# EAGLE design untitled (EAGLE 9.6.2)
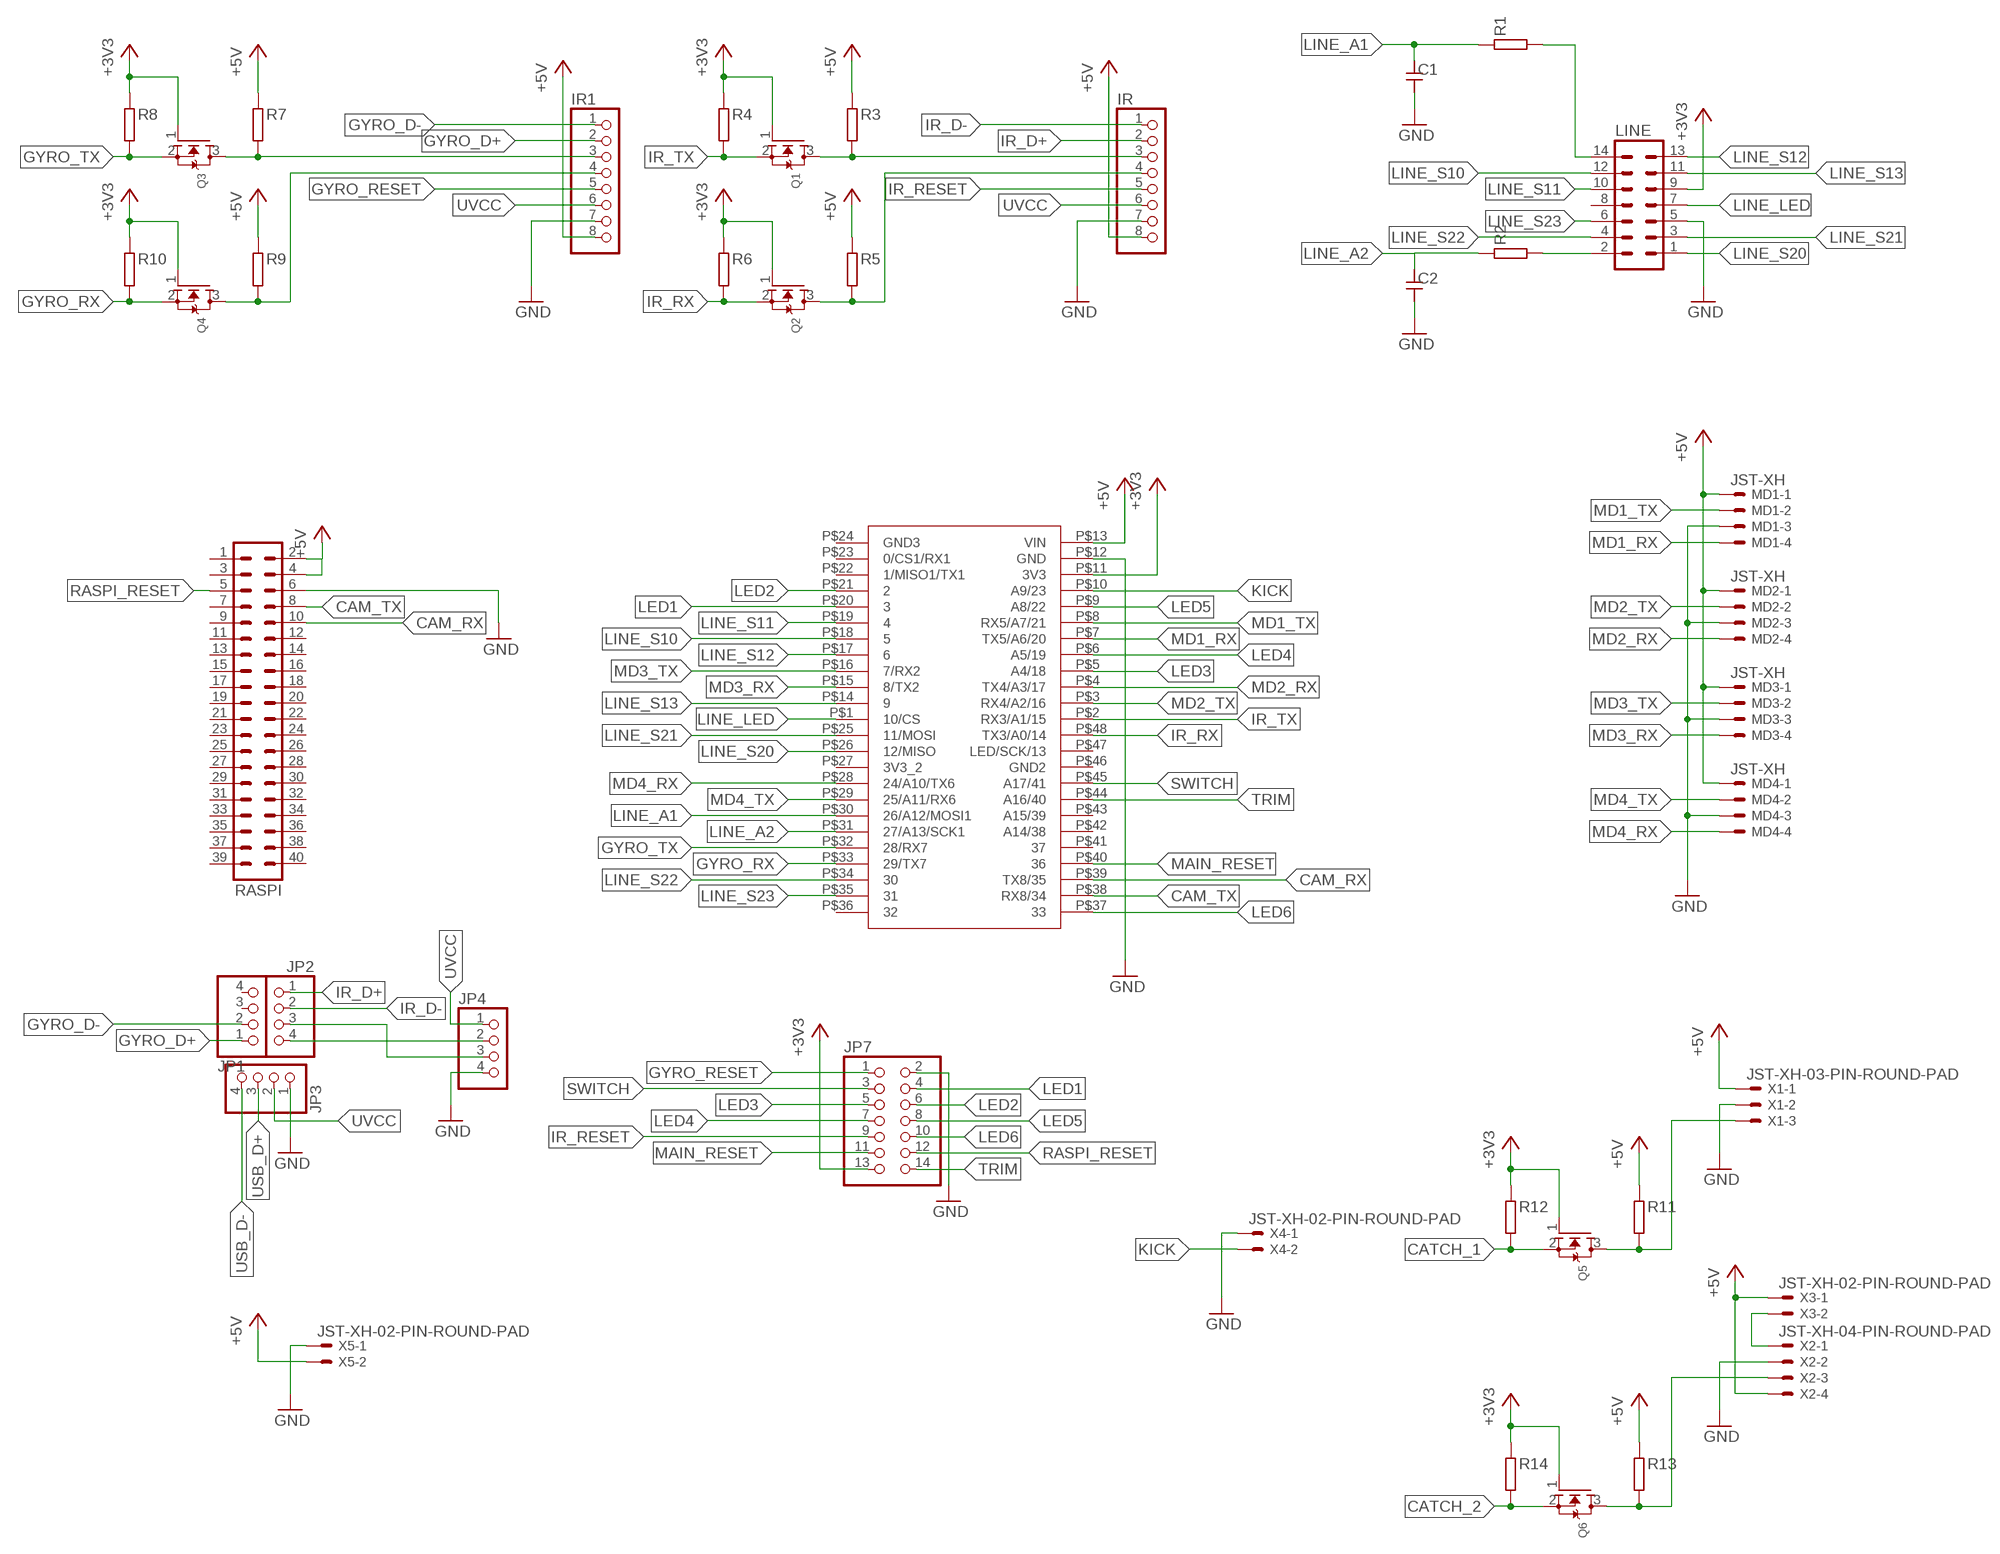
[diagram p0: schematic, sheet 1]

## Parts
C1  CAPACITOR1608  [SMD1608]
C2  CAPACITOR1608  [SMD1608]
IR  PINHD-1X8  [1X08]
IR1  PINHD-1X8  [1X08]
JP1  PINHD-1X4  [1X04]
JP2  PINHD-1X4  [1X04]
JP3  PINHD-1X4  [1X04]
JP4  PINHD-1X4  [1X04]
JP7  PINHD-2X7  [2X07]
LINE  MA07-2  [MA07-2]
MD1  JST-XH  JST-XH-04-PIN-ROUND-PAD  [JST-XH-04-PACKAGE-ROUND-PAD]
MD2  JST-XH  JST-XH-04-PIN-ROUND-PAD  [JST-XH-04-PACKAGE-ROUND-PAD]
MD3  JST-XH  JST-XH-04-PIN-ROUND-PAD  [JST-XH-04-PACKAGE-ROUND-PAD]
MD4  JST-XH  JST-XH-04-PIN-ROUND-PAD  [JST-XH-04-PACKAGE-ROUND-PAD]
Q1  MOSFET-NREFLOW  [SOT23]
Q2  MOSFET-NREFLOW  [SOT23]
Q3  MOSFET-NREFLOW  [SOT23]
Q4  MOSFET-NREFLOW  [SOT23]
Q5  MOSFET-NREFLOW  [SOT23]
Q6  MOSFET-NREFLOW  [SOT23]
R1  RESISTOR1608  [SMD1608]
R2  RESISTOR1608  [SMD1608]
R3  RESISTOR1608  [SMD1608]
R4  RESISTOR1608  [SMD1608]
R5  RESISTOR1608  [SMD1608]
R6  RESISTOR1608  [SMD1608]
R7  RESISTOR1608  [SMD1608]
R8  RESISTOR1608  [SMD1608]
R9  RESISTOR1608  [SMD1608]
R10  RESISTOR1608  [SMD1608]
R11  RESISTOR1608  [SMD1608]
R12  RESISTOR1608  [SMD1608]
R13  RESISTOR1608  [SMD1608]
R14  RESISTOR1608  [SMD1608]
RASPI  MA20-2  [MA20-2]
U$1  TEENSY4.1  [TEENSY4.1]
X1  JST-XH-03-PIN-ROUND-PAD  [JST-XH-03-PACKAGE-ROUND-PAD]
X2  JST-XH-04-PIN-ROUND-PAD  [JST-XH-04-PACKAGE-ROUND-PAD]
X3  JST-XH-02-PIN-ROUND-PAD  [JST-XH-02-PACKAGE-ROUND-PAD]
X4  JST-XH-02-PIN-ROUND-PAD  [JST-XH-02-PACKAGE-ROUND-PAD]
X5  JST-XH-02-PIN-ROUND-PAD  [JST-XH-02-PACKAGE-ROUND-PAD]

## Nets
+3V3: JP7.13 LINE.9 Q1.1(G) Q2.1(G) Q3.1(G) Q4.1(G) Q5.1(G) Q6.1(G) R4.1 R6.1 R8.1 R10.1 R12.1 R14.1 U$1.P$11(3V3)
+5V: IR1.8 IR.8 MD1.1 MD2.1 MD3.1 MD4.1 R3.1 R5.1 R7.1 R9.1 R11.1 R13.1 RASPI.2 RASPI.4 U$1.P$13(VIN) X1.1 X2.4 X3.1 X5.2
CAM_RX: RASPI.10 U$1.P$39(TX8/35)
CAM_TX: RASPI.8 U$1.P$38(RX8/34)
CATCH_1: Q5.2(S) R12.2
CATCH_2: Q6.2(S) R14.2
GND: C1.2 C2.2 IR1.7 IR.7 JP3.1 JP4.4 JP7.2 LINE.5 MD1.3 MD2.3 MD3.3 MD4.3 RASPI.6 U$1.P$12(GND) X1.2 X2.2 X4.1 X5.1
GYRO_D+: IR1.2 JP1.1
GYRO_D-: IR1.1 JP1.2
GYRO_RESET: IR1.5 JP7.1
GYRO_RX: Q4.2(S) R10.2 U$1.P$33(29/TX7)
GYRO_TX: Q3.2(S) R8.2 U$1.P$32(28/RX7)
IR_D+: IR.2 JP2.1
IR_D-: IR.1 JP2.2
IR_RESET: IR.5 JP7.9
IR_RX: Q2.2(S) R6.2 U$1.P$48(TX3/A0/14)
IR_TX: Q1.2(S) R4.2 U$1.P$2(RX3/A1/15)
KICK: U$1.P$10(A9/23) X4.2
LED1: JP7.4 U$1.P$20
LED2: JP7.6 U$1.P$21
LED3: JP7.5 U$1.P$5(A4/18)
LED4: JP7.7 U$1.P$6(A5/19)
LED5: JP7.8 U$1.P$9(A8/22)
LED6: JP7.10 U$1.P$37
LINE_A1: C1.1 R1.1 U$1.P$30(26/A12/MOSI1)
LINE_A2: C2.1 R2.1 U$1.P$31(27/A13/SCK1)
LINE_LED: LINE.7 U$1.P$1(10/CS)
LINE_S10: LINE.12 U$1.P$18
LINE_S11: LINE.10 U$1.P$19
LINE_S12: LINE.13 U$1.P$17
LINE_S13: LINE.11 U$1.P$14
LINE_S20: LINE.1 U$1.P$26(12/MISO)
LINE_S21: LINE.3 U$1.P$25(11/MOSI)
LINE_S22: LINE.4 U$1.P$34
LINE_S23: LINE.6 U$1.P$35
MAIN_RESET: JP7.11 U$1.P$40
MD1_RX: MD1.4 U$1.P$7(TX5/A6/20)
MD1_TX: MD1.2 U$1.P$8(RX5/A7/21)
MD2_RX: MD2.4 U$1.P$4(TX4/A3/17)
MD2_TX: MD2.2 U$1.P$3(RX4/A2/16)
MD3_RX: MD3.4 U$1.P$15(8/TX2)
MD3_TX: MD3.2 U$1.P$16(7/RX2)
MD4_RX: MD4.4 U$1.P$28(24/A10/TX6)
MD4_TX: MD4.2 U$1.P$29(25/A11/RX6)
N$1: IR1.3 Q3.3(D) R7.2
N$2: LINE.14 R1.2
N$3: LINE.2 R2.2
N$4: IR.3 Q1.3(D) R3.2
N$5: IR1.4 Q4.3(D) R9.2
N$6: IR.4 Q2.3(D) R5.2
N$7: Q6.3(D) R13.2 X2.3
N$8: X2.1 X3.2
N$9: Q5.3(D) R11.2 X1.3
N$10: JP2.4 JP4.2
N$11: JP2.3 JP4.3
RASPI_RESET: JP7.12 RASPI.5
SWITCH: JP7.3 U$1.P$45(A17/41)
TRIM: JP7.14 U$1.P$44(A16/40)
USB_D+: JP3.3
USB_D-: JP3.4
UVCC: IR1.6 IR.6 JP3.2 JP4.1
Unconnected: JP1.3 JP1.4 LINE.8 RASPI.1 RASPI.3 RASPI.7 RASPI.9 RASPI.11 RASPI.12 RASPI.13 RASPI.14 RASPI.15 RASPI.16 RASPI.17 RASPI.18 RASPI.19 RASPI.20 RASPI.21 RASPI.22 RASPI.23 RASPI.24 RASPI.25 RASPI.26 RASPI.27 RASPI.28 RASPI.29 RASPI.30 RASPI.31 RASPI.32 RASPI.33 RASPI.34 RASPI.35 RASPI.36 RASPI.37 RASPI.38 RASPI.39 RASPI.40 U$1.P$22(1/MISO1/TX1) U$1.P$23(0/CS1/RX1) U$1.P$24(GND3) U$1.P$27(3V3_2) U$1.P$36 U$1.P$41 U$1.P$42(A14/38) U$1.P$43(A15/39) U$1.P$46(GND2) U$1.P$47(LED/SCK/13)

## Library data of the parts
C1 C2 = generic:CAPACITOR: Generic Capacitor
IR IR1 = pinhead:PINHD-1X8: PIN HEADER
JP1-JP4 = pinhead:PINHD-1X4: PIN HEADER
JP7 = pinhead:PINHD-2X7: PIN HEADER
LINE = con-lstb:MA07-2: PIN HEADER; OC_FARNELL: unknown; OC_NEWARK: unknown
MD1-MD4 X2 = Rembrandt Electronics - JST XH Connectors v1-0:JST-XH-04-PIN: JST XH Connector 2 Pin Wire to board connector. Pitch: 2,54 mm, (0.100") Number of pins: 4 Created by Rembrandt Electronics www.rembrandtelectronics.com
Q1-Q6 = adafruit:MOSFET-N: N-Channel Mosfet 2N7002E - 60V 260mA SOT23 [Digikey: 2N7002ET1GOSTR-ND] - REEL BSH103 - 30V 850mA SOT23 [Digikey: 568-5013-1-ND]
R1-R14 = generic:RESISTOR: Generic Registor
RASPI = con-lstb:MA20-2: PIN HEADER; OC_FARNELL: unknown; OC_NEWARK: unknown
U$1 = Teensy4.0:TEENSY4.1
X1 = Rembrandt Electronics - JST XH Connectors v1-0:JST-XH-03-PIN: JST XH Connector 2 Pin Wire to board connector. Pitch: 2,54 mm, (0.100") Number of pins: 3 Created by Rembrandt Electronics www.rembrandtelectronics.com
X3-X5 = Rembrandt Electronics - JST XH Connectors v1-0:JST-XH-02-PIN: JST XH Connector 2 Pin Wire to board connector. Pitch: 2,54 mm, (0.100") Number of pins: 2 Created by Rembrandt Electronics www.rembrandtelectronics.com

## Board
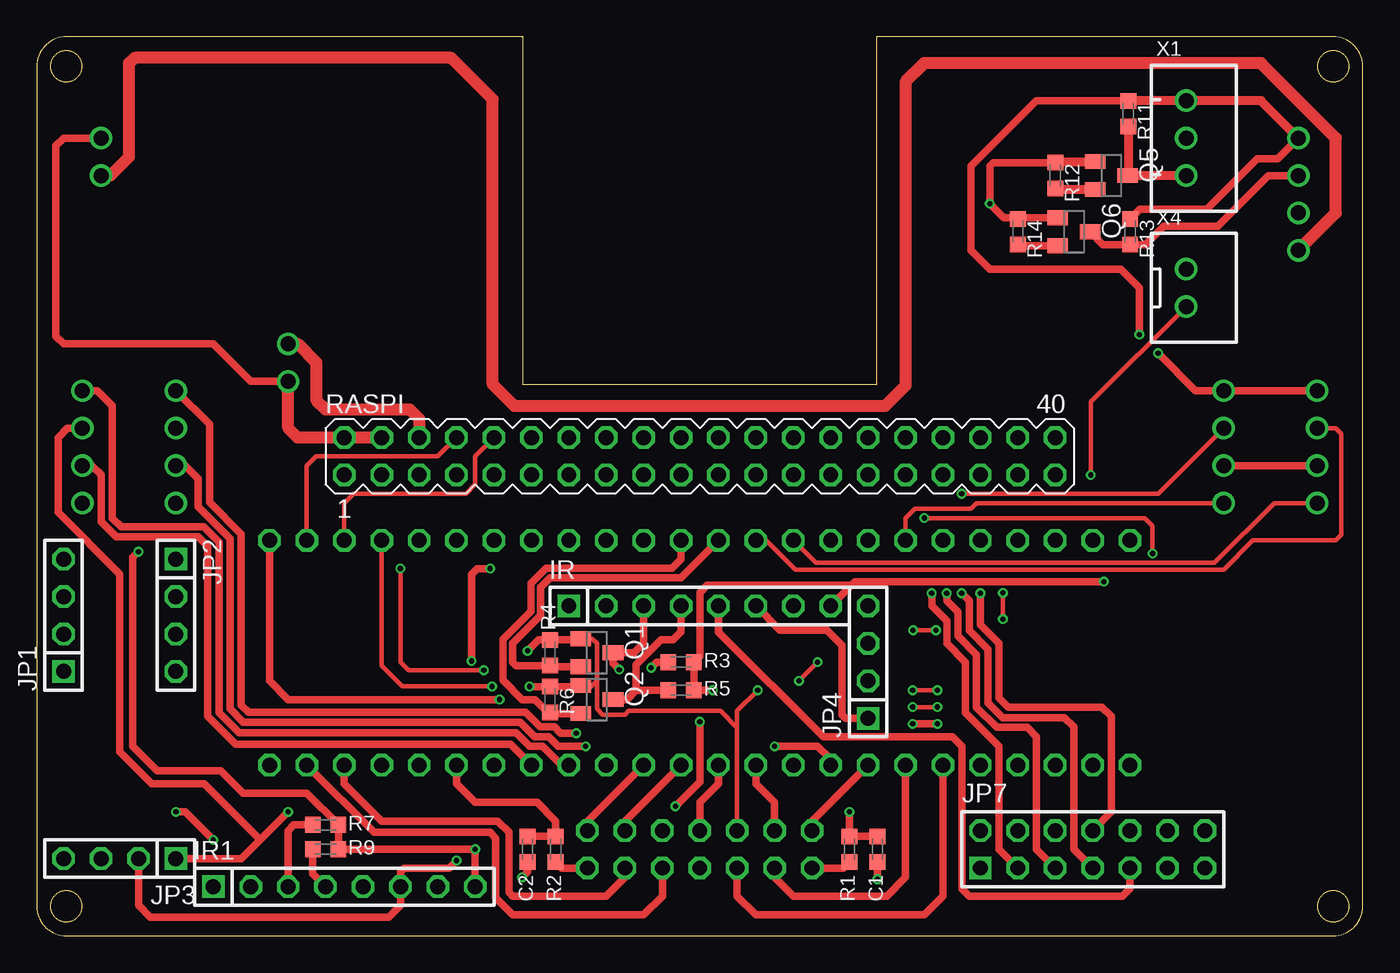
[diagram p1: board, top side]
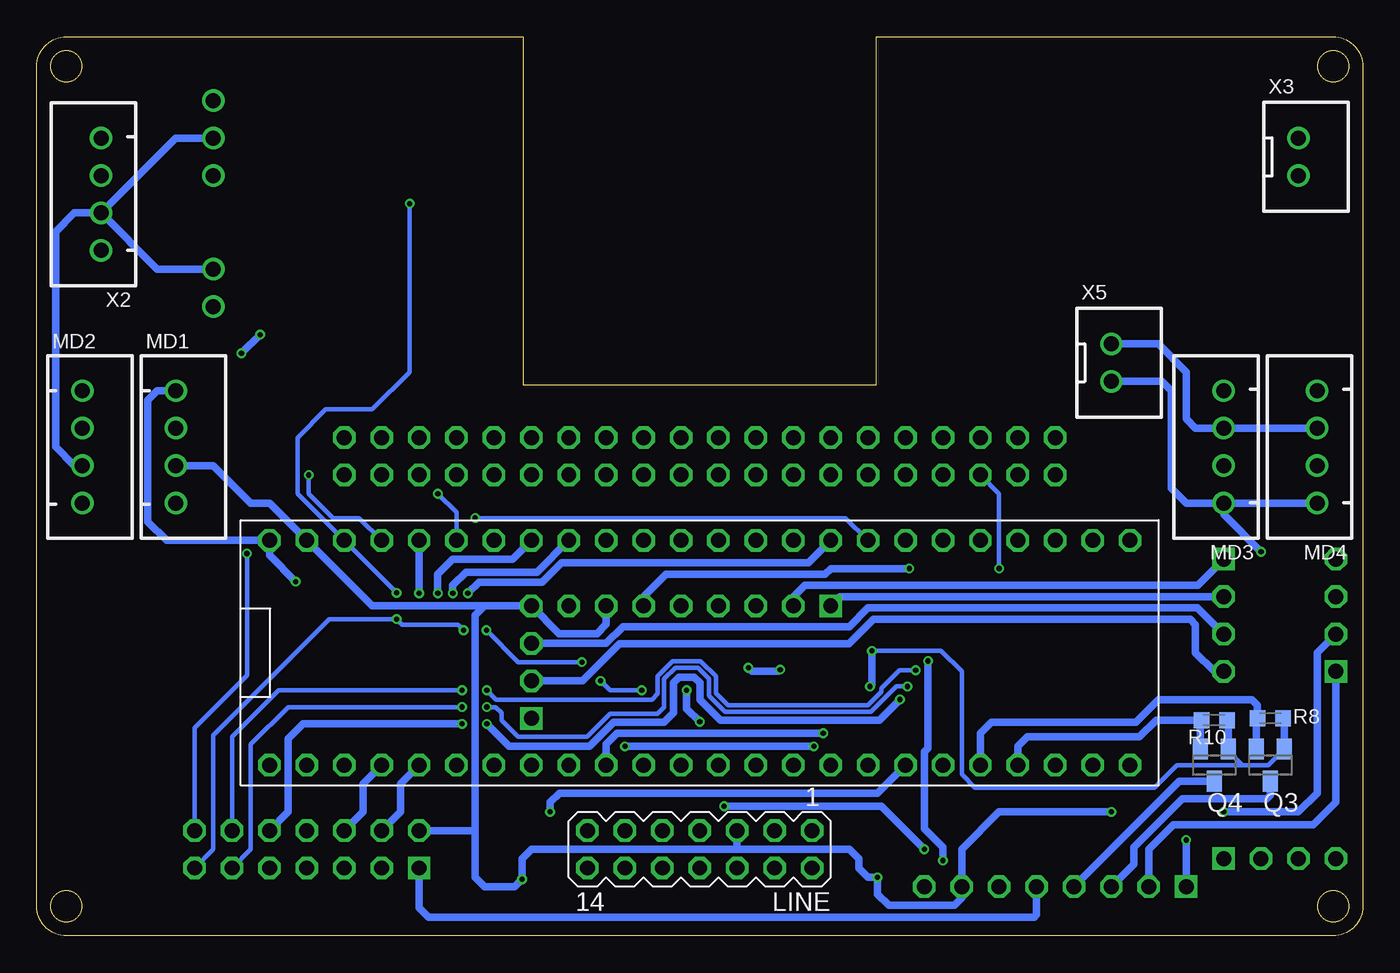
[diagram p2: board, bottom side, seen from below]

Size 90 x 61 mm. Coordinates in mm from the lower left corner, seen from the top.
Outline: 90,2 90,59 arc90 88,61 57,61 57,37.4 33,37.4 33,61 2,61 arc90 0,59 0,2 arc90 2,0 88,0 arc90 90,2
Outline: circle at 2,59 radius 1.05
Outline: circle at 88,2 radius 1.05
Outline: circle at 2,2 radius 1.05
Outline: circle at 88,59 radius 1.05
Copper layers (1*16): Top 0.035mm / dielectric 1.6mm / Bottom 0.035mm
Design rules "Elecrow_2-layer_PCB_eagle_rule": minimum track width 6mil, minimum drill 12mil, track to track 6mil, track to pad 6mil, pad to pad 6mil, via to via 8mil, smd to smd 0mil, copper to edge 20mil, drill to drill 10mil, minimum pad ring 6mil, minimum via ring 6mil, stop-mask expansion 0mil, vias tented up to drill 100mil, thermal gap 10mil

### Footprints (pad centres in the part's own frame; a part is rotated, then mirrored left to right if it is on the bottom)
SMD1608 = smd 1.05 x 1.08: 1 -0.875,0; 2 0.875,0
1X08 = drill 1.016 square: 1 -8.89,0 | drill 1.016 octagon: 2 -6.35,0; 3 -3.81,0; 4 -1.27,0; 5 1.27,0; 6 3.81,0; 7 6.35,0; 8 8.89,0
1X04 = drill 1.016 square: 1 -3.81,0 | drill 1.016 octagon: 2 -1.27,0; 3 1.27,0; 4 3.81,0
2X07 = drill 1.016 square: 1 -7.62,-1.27 | drill 1.016 octagon: 2 -7.62,1.27; 3 -5.08,-1.27; 4 -5.08,1.27; 5 -2.54,-1.27; 6 -2.54,1.27; 7 0,-1.27; 8 0,1.27; 9 2.54,-1.27; 10 2.54,1.27; 11 5.08,-1.27; 12 5.08,1.27; 13 7.62,-1.27; 14 7.62,1.27
MA07-2 = drill 1.016 octagon: 1 -7.62,-1.27; 2 -7.62,1.27; 3 -5.08,-1.27; 4 -5.08,1.27; 5 -2.54,-1.27; 6 -2.54,1.27; 7 0,-1.27; 8 0,1.27; 9 2.54,-1.27; 10 2.54,1.27; 11 5.08,-1.27; 12 5.08,1.27; 13 7.62,-1.27; 14 7.62,1.27
JST-XH-04-PACKAGE-ROUND-PAD = drill 1.016: 1 -3.81,0; 2 -1.27,0; 3 1.27,0; 4 3.81,0
SOT23 = smd 1 x 1.4: 1 -0.95,-1.1; 2 0.95,-1.1; 3 0,1.1
MA20-2 = drill 1.016 octagon: 1 -24.13,-1.27; 2 -24.13,1.27; 3 -21.59,-1.27; 4 -21.59,1.27; 5 -19.05,-1.27; 6 -19.05,1.27; 7 -16.51,-1.27; 8 -16.51,1.27; 9 -13.97,-1.27; 10 -13.97,1.27; 11 -11.43,-1.27; 12 -11.43,1.27; 13 -8.89,-1.27; 14 -8.89,1.27; 15 -6.35,-1.27; 16 -6.35,1.27; 17 -3.81,-1.27; 18 -3.81,1.27; 19 -1.27,-1.27; 20 -1.27,1.27; 21 1.27,-1.27; 22 1.27,1.27; 23 3.81,-1.27; 24 3.81,1.27; 25 6.35,-1.27; 26 6.35,1.27; 27 8.89,-1.27; 28 8.89,1.27; 29 11.43,-1.27; 30 11.43,1.27; 31 13.97,-1.27; 32 13.97,1.27; 33 16.51,-1.27; 34 16.51,1.27; 35 19.05,-1.27; 36 19.05,1.27; 37 21.59,-1.27; 38 21.59,1.27; 39 24.13,-1.27; 40 24.13,1.27
TEENSY4.1 = drill 1.016 octagon: P$1 -7.62,1.27; P$2 7.62,1.27; P$3 7.62,3.81; P$4 7.62,6.35; P$5 7.62,8.89; P$6 7.62,11.43; P$7 7.62,13.97; P$8 7.62,16.51; P$9 7.62,19.05; P$10 7.62,21.59; P$11 7.62,24.13; P$12 7.62,26.67; P$13 7.62,29.21; P$14 -7.62,3.81; P$15 -7.62,6.35; P$16 -7.62,8.89; P$17 -7.62,11.43; P$18 -7.62,13.97; P$19 -7.62,16.51; P$20 -7.62,19.05; P$21 -7.62,21.59; P$22 -7.62,24.13; P$23 -7.62,26.67; P$24 -7.62,29.21; P$25 -7.62,-1.27; P$26 -7.62,-3.81; P$27 -7.62,-6.35; P$28 -7.62,-8.89; P$29 -7.62,-11.43; P$30 -7.62,-13.97; P$31 -7.62,-16.51; P$32 -7.62,-19.05; P$33 -7.62,-21.59; P$34 -7.62,-24.13; P$35 -7.62,-26.67; P$36 -7.62,-29.21; P$37 7.62,-29.21; P$38 7.62,-26.67; P$39 7.62,-24.13; P$40 7.62,-21.59; P$41 7.62,-19.05; P$42 7.62,-16.51; P$43 7.62,-13.97; P$44 7.62,-11.43; P$45 7.62,-8.89; P$46 7.62,-6.35; P$47 7.62,-3.81; P$48 7.62,-1.27
JST-XH-03-PACKAGE-ROUND-PAD = drill 1.016: 1 -2.54,0; 2 0,0; 3 2.54,0
JST-XH-02-PACKAGE-ROUND-PAD = drill 1.016: 1 -1.27,0; 2 1.27,0

### Placement (x,y rotation side)
C1  57.06,5.87 270 top
C2  33.32,5.87 270 top
IR  45,22.38 0 top
IR1  20.87,3.33 0 top
JP1  1.82,21.75 90 top
JP2  9.44,21.75 270 top
JP3  5.63,5.23 180 top
JP4  56.43,18.57 90 top
JP7  71.67,5.87 0 top
LINE  45,5.87 180 bottom
MD1  80.56,33.17 270 bottom
MD2  86.91,33.17 270 bottom
MD3  9.44,33.17 90 bottom
MD4  3.09,33.17 90 bottom
Q1  38.02,19.2 270 top
Q2  38.02,16.03 270 top
Q3  6.27,11.58 180 bottom
Q4  10.08,11.58 180 bottom
Q5  72.94,51.59 270 top
Q6  70.4,47.78 270 top
R1  55.16,5.87 270 top
R2  35.22,5.87 270 top
R3  43.73,18.57 180 top
R4  34.84,19.2 270 top
R5  43.73,16.66 180 top
R6  34.84,16.03 270 top
R7  19.6,7.52 180 top
R8  6.27,14.76 180 bottom
R9  19.6,5.87 180 top
R10  10.08,14.63 180 bottom
R11  74.08,55.78 270 top
R12  69.13,51.59 270 top
R13  74.21,47.78 270 top
R14  66.59,47.78 270 top
RASPI  45,32.54 0 top
U$1  45,19.2 90 bottom
X1  78.02,54.13 270 top
X2  85.64,50.32 90 bottom
X3  4.36,52.86 270 bottom
X4  78.02,43.97 270 top
X5  17.06,38.89 270 bottom

### Tracks (layer width: path | path; a pad name or v marks a point on that pad's centre or on a via)
+3V3  (via drill 0.35)
  Top 0.305: Q1.1 37.7,20.16 38.02,19.84 38.02,17.3 | 38.02,17.3 37.62,16.91 36.84,16.91 | 38.02,17.3 38.02,15.39 38.4,15.01 39.92,15.01 40.17,15.27 46.4,15.27 47.54,14.12 | 47.54,14.12 LINE.9 | v65.57,23.27 v65.57,21.49 | v61.03,20.73 v59.48,20.73 | v53,18.57 v51.73,17.3 | v48.94,16.66 47.54,15.27 47.54,14.12
  Top 0.508: Q6.1 66.66,48.73 R14.1 66.51,48.73 65.64,48.73 v64.69,49.69 64.69,52.22 64.92,52.47 R12.1 | Q1.1 36.84,20.08 R4.1 34.06,20.08 v33.32,19.33 | Q2.1 36.84,16.91 R6.1 33.46,16.91 v33.44,16.92
  Top 0.61: R12.1 69.2,52.54 Q5.1
  Bottom 0.305: Q3.1 6.41,11.58 8.17,11.58 | 8.17,11.58 9.12,12.54 Q4.1 | v64.69,49.69 64.69,38.25 67.22,35.72 70.4,35.72 72.31,33.81 72.31,30 U$1.P$11 v65.57,23.27 | 8.17,11.58 12.62,11.58 14.14,10.06 26.33,10.06 27.22,10.95 27.22,17.93 28.62,19.33 v33.32,19.33 | v61.03,20.73 61.41,21.11 65.19,21.11 v65.57,21.49 70.15,21.49 78.02,13.62 78.02,5.87 JP7.13 | v59.48,20.73 57.32,18.57 v53,18.57 | v51.73,17.3 51.09,16.66 v48.94,16.66
  Bottom 0.508: v33.32,19.33 33.32,17.05 v33.44,16.92 | Q3.1 5.31,14.68 R8.1 | Q4.1 9.12,14.56 R10.1
+5V  (via drill 0.35)
  Top 0.508: R13.1 74.86,49.3 79.42,49.3 82.85,52.73 84.24,52.73 X2.4 | IR.8 55.29,23.78 | 55.29,23.78 55.54,24.03 v72.43,24.03 | MD2.1 MD1.1 78.66,36.98 v76.11,39.52 | 55.29,23.78 45.51,23.78 45,23.27 45,18.96 R3.1 R5.1 v45.89,16.66 | IR1.8 v29.76,5.87 R9.1 R7.1 18.32,9.68 14.01,9.68 12.49,11.2 8.17,11.2 6.52,12.85 6.52,25.68 v6.9,26.06 | X5.2 14.52,37.62 11.98,40.16 1.82,40.16 1.3,40.68 1.3,53.61 1.82,54.13 X3.1 | v43.35,8.79 45,10.44 v45,14.53 | R11.1 67.85,56.66 63.41,52.22 63.41,46.51 64.69,45.24 73.58,45.24 74.84,43.97 v74.84,40.8
  Top 0.61: R11.1 78.01,56.66 X1.1 83.1,56.67 X2.4
  Top 0.813: RASPI.4 RASPI.2 17.7,33.81 17.06,34.45 X5.2
  Bottom 0.508: v72.43,24.03 74.21,25.81 U$1.P$13 81.19,26.82 82.47,28.09 82.47,36.35 81.83,36.98 MD1.1 | MD3.1 MD4.1 | MD3.1 11.98,29.37 13,30.38 13,36.98 13.63,37.62 X5.2 | v29.76,5.87 32.68,8.79 v43.35,8.79 | v45,14.53 45.89,15.42 v45.89,16.66 | v74.84,40.8 v76.11,39.52 | v6.9,26.06 9.44,28.6 MD3.1
CAM_RX
  Top 0.305: RASPI.10 29.76,32.54 29.76,30.63 29.12,30 21.5,30 20.87,29.37 U$1.P$39
CAM_TX
  Top 0.305: RASPI.8 27.22,32.54 18.96,32.54 18.33,31.91 U$1.P$38
CATCH_1
  Top 0.61: Q5.2 69.2,50.64 R12.2
CATCH_2
  Top 0.508: Q6.2 66.66,46.83 R14.2
GND  (via drill 0.35)
  Top 0.508: MD2.3 MD1.3 | v32.94,3.96 33.32,4.35 C2.2 | JP3.1 13.89,5.23 15.16,6.5 | 15.16,6.5 v17.06,8.41 | C1.2 v57.06,3.84 | 15.16,6.5 11.34,10.31 7.79,10.31 5.63,12.47 5.63,24.54 1.44,28.73 1.44,33.81 2.07,34.45 MD4.3
  Top 0.813: X5.1 17.7,40.16 18.96,38.89 18.96,36.35 19.6,35.72 25.32,35.72 25.95,35.08 RASPI.6
  Bottom 0.508: X1.2 80.56,54.13 X2.2 | X2.2 81.83,45.24 X4.1 | MD1.3 78.02,31.91 75.48,29.37 74.21,29.37 U$1.P$12 67.22,22.38 JP4.4 | JP4.4 54.55,20.5 51.98,20.5 51.35,21.13 IR.7 | MD4.3 MD3.3 11.34,34.45 11.98,35.08 11.98,38.25 13.89,40.16 X5.1 | v17.06,8.41 24.68,8.41 27.22,5.87 IR1.7 27.22,2.57 27.73,2.06 32.17,2.06 32.94,2.82 v32.94,3.96 33.57,3.96 34.2,4.6 34.2,5.23 34.84,5.87 42.46,5.87 | JP4.4 59.61,22.38 60.24,21.75 60.24,7.14 | 60.24,7.14 60.24,3.96 59.61,3.33 57.57,3.33 v57.06,3.84 57.06,5.23 56.43,5.87 42.46,5.87 | LINE.5 42.46,5.87 | X2.2 87.46,49.05 88.73,47.78 88.73,33.17 87.46,31.91 MD2.3 | JP7.2 60.24,7.14
GYRO_D+
  Bottom 0.508: JP1.1 1.82,9.04 3.34,7.52 12.87,7.52 14.52,5.87 IR1.2
GYRO_D-  (via drill 0.35)
  Top 0.508: v11.98,6.5 10.08,8.41 v9.44,8.41
  Bottom 0.508: v11.98,6.5 IR1.1 | v9.44,8.41 4.36,8.41 3.09,9.68 3.09,19.2 JP1.2
GYRO_RESET
  Bottom 0.508: IR1.5 22.14,1.43 22.29,1.27 63.41,1.27 64.05,1.91 JP7.1
GYRO_RX
  Bottom 0.508: Q4.2 11.02,14.56 R10.2 14.01,14.63 15.16,13.49 22.77,13.49 23.41,12.85 U$1.P$33
GYRO_TX
  Bottom 0.508: Q3.2 7.22,14.68 R8.2 7.14,15.63 7.53,16.03 13.89,16.03 15.41,14.51 25.19,14.51 25.95,13.74 U$1.P$32
IR_D+
  Bottom 0.508: JP2.1 11.19,23.8 37.86,23.8 38.65,23.02 IR.2
IR_D-
  Bottom 0.508: JP2.2 35.48,23.02 IR.1
IR_RESET
  Top 0.508: IR.5 46.27,20.6 53.38,13.49 62.14,13.49 62.78,12.85 62.78,3.2 63.29,2.7 73.7,2.7 74.21,3.2 JP7.9
IR_RX
  Top 0.508: Q2.2 34.91,15.08 | 34.91,15.08 R6.2 | U$1.P$48 43.73,25.55 43.12,24.95 34.57,24.95 33.55,23.92 33.55,22.02 31.64,20.11 31.64,17.32 32.94,16.03 33.82,16.03 34.77,15.08 34.91,15.08
IR_TX
  Top 0.508: Q1.2 34.91,18.25 R4.2 32.54,18.33 32.3,18.57 32.3,19.84 34.2,21.75 34.2,23.65 34.84,24.29 43.73,24.29 U$1.P$2
KICK  (via drill 0.35)
  Top 0.305: X4.2 71.54,36.22 v71.54,31.27
  Bottom 0.305: v71.54,31.27 71.54,30 69.89,28.35 68.11,28.35 U$1.P$10
LED1
  Bottom 0.508: U$1.P$20 65.32,10.31 65.32,8.41 JP7.4
LED2
  Bottom 0.508: U$1.P$21 67.86,10.31 67.86,8.41 JP7.6
LED3  (via drill 0.35)
  Top 0.508: v61.76,23.25 61.76,22.74 62.53,21.98 62.53,20.35 63.8,19.08 63.8,15.52 65.17,14.15 67.22,14.15 67.86,13.52 67.86,5.87 JP7.5
  Bottom 0.508: v61.76,23.25 61.76,23.78 60.88,24.67 56.05,24.67 U$1.P$5
LED4  (via drill 0.35)
  Top 0.508: v62.78,23.25 63.29,22.74 63.29,20.73 64.56,19.46 64.56,15.83 65.57,14.81 69.77,14.81 70.4,14.18 70.4,5.87 JP7.7
  Bottom 0.508: U$1.P$6 57.7,25.55 61.76,25.55 62.78,24.54 v62.78,23.25
LED5  (via drill 0.35)
  Top 0.508: v64.05,23.25 64.05,21.11 65.32,19.84 65.32,16.16 65.95,15.52 72.31,15.52 72.94,14.89 72.94,8.41 JP7.8
  Bottom 0.508: U$1.P$9 v64.05,23.25
LED6  (via drill 0.35)
  Top 0.508: U$1.P$37 15.79,17.3 17.06,16.03 v31.41,16.03 | v59.45,14.38 v61.13,14.38
  Bottom 0.508: v31.41,16.03 32.81,14.63 43.6,14.63 45,16.03 45,17.17 45.38,17.55 46.4,17.55 46.78,17.17 46.78,15.14 47.41,14.51 50.84,14.51 52.49,12.85 57.93,12.85 v59.45,14.38 | v61.13,14.38 71.92,14.38 72.94,13.36 72.94,8.41 JP7.10
LINE_A1  (via drill 0.35)
  Top 0.508: v55.16,8.41 R1.1 C1.1
  Bottom 0.508: U$1.P$30 32.94,9.68 54.52,9.68 55.16,9.04 v55.16,8.41
LINE_A2
  Top 0.508: U$1.P$31 28.49,10.31 29.76,9.04 33.95,9.04 35.22,7.77 R2.1 C2.1
LINE_LED
  Top 0.508: LINE.7 45,9.04 46.27,10.31 U$1.P$1
LINE_S10
  Top 0.508: LINE.12 50.08,3.96 51.35,2.7 57.7,2.7 58.97,3.96 U$1.P$18
LINE_S11
  Top 0.508: LINE.10 47.54,2.7 48.81,1.43 60.24,1.43 61.51,2.7 U$1.P$19
LINE_S12
  Top 0.508: LINE.13 52.62,7.77 U$1.P$17
LINE_S13
  Top 0.508: LINE.11 50.08,9.04 48.81,10.31 U$1.P$14
LINE_S20
  Top 0.508: U$1.P$26 37.38,7.77 LINE.1
LINE_S21
  Top 0.508: LINE.3 39.92,7.77 U$1.P$25
LINE_S22
  Top 0.508: U$1.P$34 20.87,10.31 23.41,7.77 31.03,7.77 31.28,7.77 32.05,7.01 32.05,2.95 32.3,2.7 38.65,2.7 39.92,3.96 LINE.4
LINE_S23
  Top 0.508: LINE.6 42.46,2.7 41.19,1.43 32.3,1.43 31.16,2.57 31.16,6.63 30.78,7.01 22.9,7.01 U$1.P$35
MAIN_RESET  (via drill 0.35)
  Top 0.305: U$1.P$40 23.41,18.32 24.81,16.92 v30.9,16.92 | v59.45,15.52 v61.13,15.52
  Bottom 0.305: v30.9,16.92 31.66,16.92 33.39,15.19 43.27,15.19 44.37,16.28 44.37,17.43 45.13,18.19 46.65,18.19 47.41,17.43 47.41,15.52 47.87,15.06 51.07,15.06 52.65,13.49 57.32,13.49 58.46,14.63 58.46,15.14 58.84,15.52 v59.45,15.52 | v61.13,15.52 72.94,15.52 75.48,12.98 75.48,5.87 JP7.11
MD1_RX
  Top 0.305: U$1.P$7 58.97,28.35 59.61,28.98 63.41,28.98 63.8,29.37 MD1.4
MD1_TX  (via drill 0.35)
  Top 0.305: MD1.2 76.11,30 v62.78,30
  Bottom 0.305: v62.78,30 61.51,28.73 U$1.P$8
MD2_RX
  Top 0.305: U$1.P$4 52.87,25.3 79.92,25.3 83.99,29.37 MD2.4
MD2_TX
  Top 0.305: U$1.P$3 49.51,26.82 51.49,24.84 55.16,24.84 80.56,24.84 82.54,26.82 88.18,26.82 88.56,27.21 88.56,34.06 88.18,34.45 MD2.2
MD3_RX  (via drill 0.35)
  Top 0.508: MD3.4 11.73,34.7 11.73,29.41 13.89,27.25 13.89,15.65 14.37,15.17 27.22,15.17 33.16,15.17 34.15,14.18 35.13,14.18 35.56,13.74 v36.62,13.74
  Bottom 0.508: U$1.P$15 51.35,13 50.61,13.74 v36.62,13.74
MD3_TX  (via drill 0.35)
  Top 0.508: MD3.2 10.08,31.91 10.96,31.02 10.96,29.11 13.12,26.95 13.12,15.39 14.01,14.51 32.81,14.51 33.8,13.52 34.73,13.52 35.39,12.85 v37.25,12.85 | U$1.P$16 53.89,11.97 53,12.85 v50.08,12.85
  Bottom 0.508: v37.25,12.85 v50.08,12.85
MD4_RX
  Top 0.508: MD4.4 4.11,36.98 5.12,35.97 5.12,28.35 5.73,27.74 11.32,27.74 12.36,26.7 12.36,15.14 13.73,13.77 32.53,13.77 33.44,12.85 34.33,12.85 35.6,11.58 U$1.P$28
MD4_TX
  Top 0.508: MD4.2 3.73,31.91 4.36,31.27 4.36,28.09 5.38,27.08 10.96,27.08 11.6,26.44 11.6,14.89 13.5,12.98 32.17,12.98 U$1.P$29
N$1
  Top 0.508: R7.2 17.44,7.52 17.06,7.14 IR1.3
  Bottom 0.508: Q3.3 6.27,9.55 6.52,9.3 12.23,9.3 15.54,6 15.54,4.85 IR1.3
N$2
  Top 0.508: R1.2 54.77,4.6 LINE.14
N$3
  Top 0.508: LINE.2 35.62,4.6 R2.2
N$4  (via drill 0.35)
  Top 0.508: IR.3 41.19,19.84 40.55,19.2 Q1.3 39.12,18.49 v39.54,18.06 | R3.2 42.08,18.57 v41.7,18.19
  Bottom 0.508: v41.7,18.19 41.44,17.93 39.67,17.93 v39.54,18.06
N$5
  Top 0.508: R9.2 18.73,4.2 IR1.4
  Bottom 0.508: Q4.3 12.45,10.48 IR1.4
N$6
  Top 0.508: IR.4 43.73,20.64 43.18,20.09 42.38,20.09 40.68,18.4 40.68,16.66 | R5.2 40.68,16.66 | Q2.3 40.05,16.03 40.68,16.66
N$7
  Top 0.508: Q6.3 72.38,46.91 R13.2 75.24,46.91 76.5,48.16 80.18,48.16 83.61,51.59 X2.3
N$8
  Top 0.813: X2.1 88.18,49.05 88.18,54.13 83.1,59.21 60.24,59.21 58.97,57.94 58.97,37.34 57.59,35.96 32.41,35.96 30.94,37.43 30.94,56.76 28.12,59.58 6.63,59.58 6.27,59.21 6.27,52.86 4.99,51.59 X3.2
N$9
  Top 0.61: R11.2 74.08,51.63 | 74.08,51.63 Q5.3 | X1.3 74.13,51.59 74.08,51.63
N$10
  Bottom 0.508: JP4.2 52.96,17.3 50.44,19.81 34.87,19.81 33.21,21.47 11.7,21.47 11.34,21.11 11.34,19.2 10.08,17.93 JP2.4
N$11
  Bottom 0.508: JP4.3 51.35,19.84 50.21,20.98 34.84,20.98 33.57,22.25 11.22,22.25 JP2.3
RASPI_RESET  (via drill 0.35)
  Top 0.305: v24.68,24.92 24.68,18.57 25.23,18.02 v30.35,18.02 | v59.45,16.66 v61.13,16.66
  Bottom 0.305: RASPI.5 24.68,30 v24.68,24.92 | v30.35,18.02 31.46,18.02 32.68,16.79 32.68,16.55 33.58,15.65 43.08,15.65 43.91,16.47 43.91,17.62 44.94,18.65 46.84,18.65 47.87,17.62 47.87,16.41 48.25,16.03 58.82,16.03 v59.45,16.66 | v61.13,16.66 73.58,16.66 76.75,13.49 JP7.12
SWITCH  (via drill 0.35)
  Top 0.508: v60.75,23.25 60.75,22.38 61.76,21.36 61.76,19.84 63.03,18.57 63.03,15.14 65.32,12.85 65.32,5.87 JP7.3
  Bottom 0.508: U$1.P$45 37.63,25.3 54.4,25.3 55.69,24.01 59.99,24.01 v60.75,23.25
TRIM  (via drill 0.35)
  Top 0.305: v60.24,28.35 75.23,28.35 75.73,27.84 v75.73,25.94
  Bottom 0.305: U$1.P$44 35.09,28.35 v60.24,28.35 | v75.73,25.94 75.73,17.68 79.29,14.12 JP7.14
UVCC  (via drill 0.35)
  Top 0.508: IR.6 50.46,20.73 53.64,20.73 54.65,19.71 54.65,15.01 54.91,14.76 JP4.1 | JP3.2 6.9,2.06 7.69,1.27 23.89,1.27 24.68,2.06 IR1.6 24.68,4.35 24.93,4.6 27.98,4.6 v28.49,5.11 | v30.78,24.92 29.89,24.92 29.51,24.54 v29.51,18.65
  Bottom 0.508: IR.6 48.81,23.02 47.29,24.54 36.49,24.54 36.11,24.92 v30.78,24.92 | v29.51,18.65 29.51,12.73 29.76,12.47 29.76,7.27 28.49,6 v28.49,5.11